# EAGLE design FioSaber Prototype A (EAGLE 6.5.0)
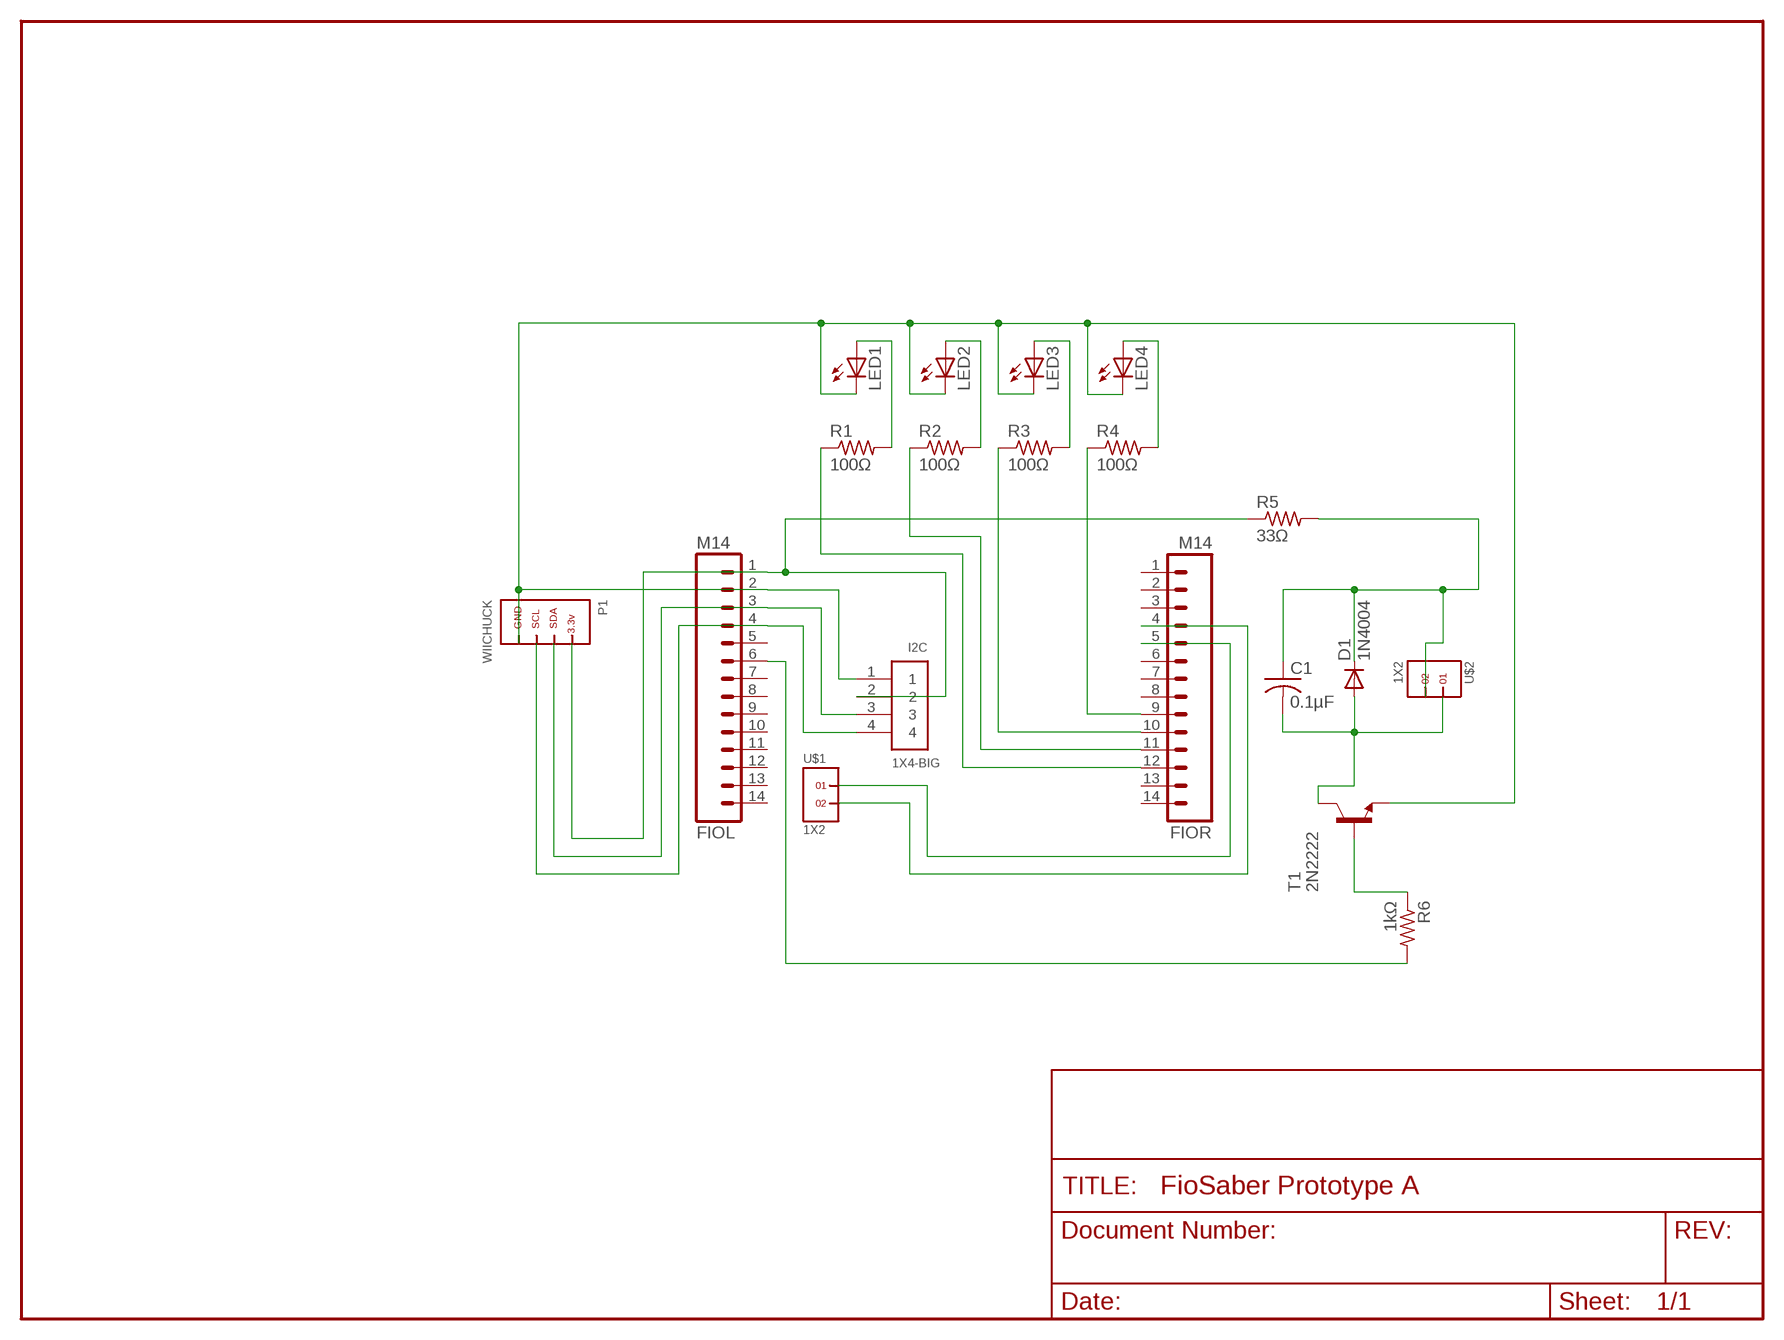
[diagram p0: schematic, sheet 1]

## Parts
C1  0.1µF  C-US025-025X050  [C025-025X050]
D1  1N4004  [DO41-10]
FIOL  M14  [1X14]
FIOR  M14  [1X14]
I2C  1X4-BIG  [1X04-BIG]
LED1  LED3MM  [LED3MM]
LED2  LED3MM  [LED3MM]
LED3  LED3MM  [LED3MM]
LED4  LED3MM  [LED3MM]
P1  WIICHUCK  [MEMOREX_RECEIVER]
R1  100Ω  R-US_0207/10  [0207/10]
R2  100Ω  R-US_0207/10  [0207/10]
R3  100Ω  R-US_0207/10  [0207/10]
R4  100Ω  R-US_0207/10  [0207/10]
R5  33Ω  R-US_0207/10  [0207/10]
R6  1kΩ  R-US_0207/10  [0207/10]
T1  2N2222  [TO92-EBC-OVAL]
U$1  1X2  [1X2]
U$2  1X2  [1X2]

## Nets
N$1: FIOL.1 I2C.2 P1.PWR R5.1
N$3: FIOL.3 I2C.3 P1.SDA
N$4: FIOL.4 I2C.4 P1.SCL
N$5: FIOR.12 R1.1
N$6: FIOR.11 R2.1
N$7: FIOR.10 R3.1
N$8: FIOR.9 R4.1
N$9: LED1.A R1.2
N$10: LED2.A R2.2
N$11: LED3.A R3.2
N$12: LED4.A R4.2
N$13: FIOL.2 I2C.1 LED1.K(C) LED2.K(C) LED3.K(C) LED4.K(C) P1.GND T1.E
N$14: FIOR.4 U$1.2
N$15: FIOR.5 U$1.1
N$16: FIOL.6 R6.2
N$18: R6.1 T1.B
N$19: C1.2 D1.A T1.C U$2.1
N$20: C1.1 D1.C R5.2 U$2.2
Unconnected: FIOL.5 FIOL.7 FIOL.8 FIOL.9 FIOL.10 FIOL.11 FIOL.12 FIOL.13 FIOL.14 FIOR.1 FIOR.2 FIOR.3 FIOR.6 FIOR.7 FIOR.8 FIOR.13 FIOR.14

## Library data of the parts
C1 = rcl:C-US: CAPACITOR, American symbol
D1 = adafruit:1N4004: DIODE General purpose 1N400x type rectifier (With bigger pads) http://www.ladyada.net/library/pcb/eaglelibrary.html
FIOL FIOR = SparkFun:M14: Header 14 Standard 14-pin 0.1" header. Use with straight break away headers (SKU : PRT-00116), right angle break away headers (PRT-00553), swiss pins (PRT-00743), machine pins (PRT-00117), and female headers (PRT-00115).
I2C = adafruit:1X4: 4-pin connector
LED1-LED4 = adafruit:LED: LED OSRAM: - CHIPLED LG R971, LG N971, LY N971, LG Q971, LY Q971, LO R971, LY R971 LH N974, LH R974 LS Q976, LO Q976, LY Q976 LO Q996 - Hyper CHIPLED LW Q18S LB Q993, LB Q99A, LB R99A - SideLED LS A670, LO A670, LY A670, LG A670, LP A670 LB A673, LV A673, LT A673, LW A673 LH A674 LY A675 LS A676, LA A676, LO A676, LY A676, LW A676 LS A679, LY A679, LG A679 - Hyper Micro SIDELED® LS Y876, LA Y876, LO Y876, LY Y876 LT Y87S - SmartLED LW L88C, LW L88S LB L89C, LB L89S, LG L890 LS L89K, LO L89K, LY L89K LS L896, LA L896, LO L896, LY L896 - TOPLED LS T670, LO T670, LY T670, LG T670, LP T670 LSG T670, LSP T670, LSY T670, LOP T670, LYG T670 LG T671, LOG T671, LSG T671 LB T673, LV T673, LT T673, LW T673 LH T674 LS T676, LA T676, LO T676, LY T676, LB T676, LH T676, LSB T676, LW T676 LB T67C, LV T67C, LT T67C, LS T67K, LO T67K, LY T67K, LW E67C LS E67B, LA E67B, LO E67B, LY E67B, LB E67C, LV E67C, LT E67C LW T67C LS T679, LY T679, LG T679 LS T770, LO T770, LY T770, LG T770, LP T770 LB T773, LV T773, LT T773, LW T773 LH T774 LS E675, LA E675, LY E675, LS T675 LS T776, LA T776, LO T776, LY T776, LB T776 LHGB T686 LT T68C, LB T68C - Hyper Mini TOPLED® LB M676 - Mini TOPLED Santana® LG M470 LS M47K, LO M47K, LY M47K Source: http://www.osram.convergy.de/
P1 = nintendo:WIICHUCK
R1-R6 = adafruit:R-US_: RESISTOR, American symbol
T1 = adafruit:2N2222: NPN TRANSISTOR Big oval pads
U$1 U$2 = headers(.1in):1X2

## Net classes
0 Default: width 0.203 mm, clearance 0.205 mm
2 LEDPower: width 0.203 mm
3 ButtonSignal: width 0.203 mm

## Board
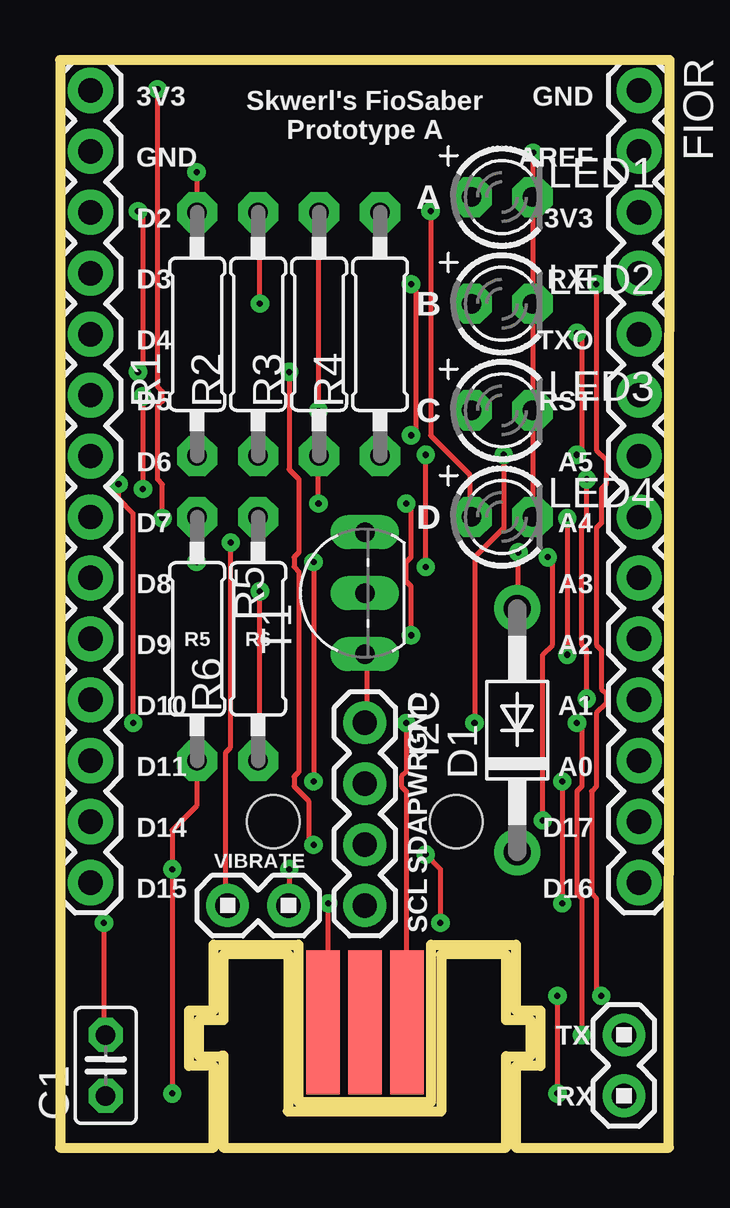
[diagram p1: board, top side]
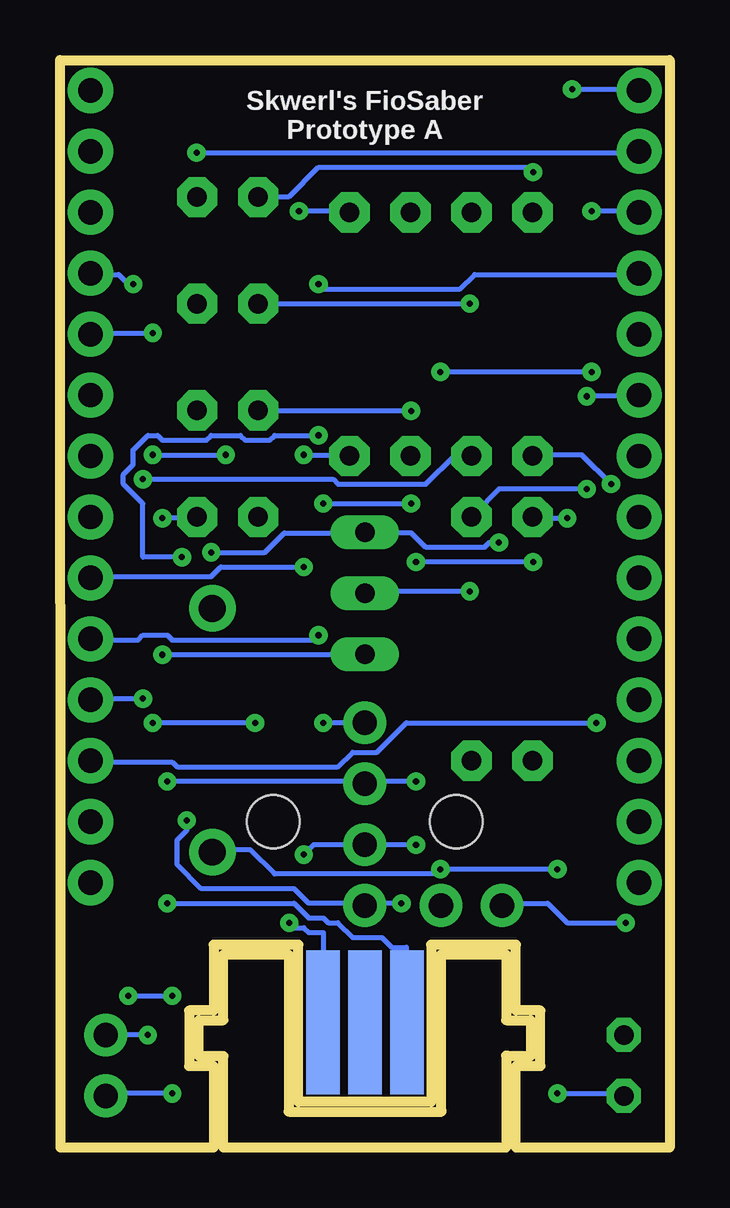
[diagram p2: board, bottom side, seen from below]

Size 25.4 x 45.34 mm. Coordinates in mm from the lower left corner, seen from the top.
Outline: 0,0 6.4,0 6.4,3.4 5.38,3.4 5.38,5.71 6.4,5.71 6.4,8.46 9.93,8.46 9.93,1.91 15.47,1.91 15.47,8.46 19,8.46 19,5.71 20.02,5.71 20.02,3.4 19,3.4 19,0 25.38,0 25.4,45.34 0,45.34 0,0
Copper layers (1*16): Top 0.035mm / dielectric 1.5mm / Bottom 0.035mm
Design rules "SparkFun *": minimum track width 8mil, minimum drill 10mil, track to track 7mil, track to pad 7mil, pad to pad 7mil, via to via 7mil, smd to smd 7mil, copper to edge 10mil, drill to drill 8mil, minimum pad ring 12mil, minimum via ring 10mil, stop-mask expansion 4mil, vias tented up to drill 20mil, thermal gap 10mil
Holes 2.2 mm at 8.89,13.59 16.51,13.59
Milling: area 5.8,0 to 19.6,8.1

### Footprints (pad centres in the part's own frame; a part is rotated, then mirrored left to right if it is on the bottom)
C025-025X050 = drill 0.813 octagon: 1 -1.27,0; 2 1.27,0
DO41-10 = drill 1.118 pad 1.93: A 5.08,0; C -5.08,0
1X14 = drill 1.016 pad 1.88: 1 0,0; 2 2.54,0; 3 5.08,0; 4 7.62,0; 5 10.16,0; 6 12.7,0; 7 15.24,0; 8 17.78,0; 9 20.32,0; 10 22.86,0; 11 25.4,0; 12 27.94,0; 13 30.48,0; 14 33.02,0
1X04-BIG = drill 1.016 pad 1.778: 1 0,0; 2 2.54,0; 3 5.08,0; 4 7.62,0
LED3MM = drill 0.813 pad 1.676 octagon: A -1.27,0; K 1.27,0
MEMOREX_RECEIVER = smd 1.4 x 6 bottom: ATT 0,5.6; PWR -1.75,5.6; SDA 1.75,5.6 | smd 1.4 x 6: GND 1.75,5.6; NC 0,5.6; SCL -1.75,5.6
0207/10 = drill 0.813 pad 1.676 octagon: 1 -5.08,0; 2 5.08,0
TO92-EBC-OVAL = drill 0.813 long: B 0,-1.27; C 2.54,-1.27; E -2.54,-1.27
1X2 = drill 1.016 pad 1.778: 1 0,0; 2 2.54,0

### Placement (x,y rotation side)
C1  1.91,3.43 90 top
D1  19.05,17.4 90 top
FIOL  1.27,44.07 270 top
FIOR  24.13,44.07 270 top
I2C  12.7,17.72 270 top
LED1  18.41,39.62 0 top
LED2  18.41,35.18 0 top
LED3  18.41,30.73 0 top
LED4  18.41,26.29 0 top
P1  12.7,-0.38 0 top
R1  5.71,33.91 90 top
R2  8.26,33.91 90 top
R3  10.79,33.91 90 top
R4  13.34,33.91 90 top
R5  5.71,21.21 270 top
R6  8.26,21.21 90 top
T1  11.43,23.11 90 top
U$1  23.5,4.7 270 top
U$2  6.99,10.1 0 top

### Tracks (layer width: path | path; a pad name or v marks a point on that pad's centre or on a via)
N$1  (via drill 0.25)
  Top 0.203: v10.57,24.41 v10.57,15.27 | v5.69,24.41 5.69,26.24 R5.1 | v4.06,44.12 4.06,31.73 4.27,31.52 4.27,31.11 4.06,30.91 4.06,27.86 4.27,27.66 v4.27,26.24 | v20.93,15.27 v20.93,10.19
  Bottom 0.203: v10.57,15.27 12.6,15.27 I2C.2 12.8,15.27 v20.93,15.27 | v5.69,24.41 v10.57,24.41 | v4.06,44.12 1.42,44.12 FIOL.1 | v4.27,26.24 5.69,26.24 R5.1 | v20.93,10.19 15.65,10.19 15.04,9.58 14.43,9.58 14.22,9.37 13.82,9.37 13.21,8.76 11.99,8.76 11.58,8.36 10.97,8.36 10.97,5.31 P1.PWR
N$3  (via drill 0.25)
  Top 0.203: v10.57,12.62 10.36,12.83 10.36,14.45 9.75,15.06 9.75,15.47 9.96,15.67 9.96,24 9.75,24.21 9.75,24.61 9.96,24.82 9.96,27.86 9.55,28.27 v9.55,32.33 | v3.25,32.33 3.45,32.54 3.45,38.84 v3.25,39.04 | v15.85,9.37 15.85,11.61 v15.24,12.22
  Bottom 0.203: v10.57,12.62 12.6,12.62 I2C.3 12.8,12.62 14.83,12.62 v15.24,12.22 | v3.25,32.33 v9.55,32.33 | v3.25,39.04 1.42,39.04 FIOL.3 | v15.85,9.37 15.65,9.17 15.24,9.17 15.04,8.97 14.43,8.97 14.43,5.31 P1.SDA
N$4  (via drill 0.25)
  Top 0.203: v11.18,10.19 11.18,7.34 10.97,7.14 10.97,5.31 P1.SCL | v14.63,35.99 14.83,35.79 14.83,29.9 v14.63,29.69 | v20.32,24.61 20.52,24.41 20.52,20.95 20.12,20.55 v20.12,13.64
  Bottom 0.203: v11.18,10.19 12.6,10.19 I2C.4 12.8,10.19 15.04,10.19 15.65,10.79 19.51,10.79 20.52,11.81 20.52,12.83 20.12,13.23 v20.12,13.64 | v14.63,35.99 14.43,35.79 8.74,35.79 8.13,36.4 1.42,36.4 FIOL.4 | v14.63,29.69 16.46,29.69 16.66,29.49 17.68,29.49 17.88,29.69 19.1,29.69 19.3,29.49 21.13,29.49 21.34,29.69 21.74,29.69 22.35,29.08 22.35,28.47 22.76,28.07 22.76,27.66 21.95,26.85 21.95,24.61 v20.32,24.61
N$5  (via drill 0.25)
  Top 0.203: v2.44,27.66 2.44,27.05 3.05,26.44 v3.05,17.7
  Bottom 0.203: v2.44,27.66 3.66,28.88 5.69,28.88 R1.1 | v3.05,17.7 10.97,17.7 12.19,16.48 13.21,16.48 13.82,15.88 20.52,15.88 20.73,16.08 23.98,16.08 FIOR.12
N$6  (via drill 0.25)
  Top 0.203: v21.95,27.86 21.95,26.04 21.74,25.83 21.74,20.95 21.95,20.75 v21.95,18.72
  Bottom 0.203: v21.95,27.86 14.02,27.86 13.82,27.66 10.16,27.66 8.94,28.88 8.33,28.88 R2.1 | v21.95,18.72 23.98,18.72 FIOR.11
N$7  (via drill 0.25)
  Top 0.203: v10.77,26.85 10.77,28.68 R3.1 | v14.43,26.85 14.63,26.64 14.63,24.61 14.43,24.41 14.43,23.6 14.63,23.39 v14.63,21.36
  Bottom 0.203: v14.43,26.85 v10.77,26.85 | v14.63,21.36 14.83,21.16 20.73,21.16 20.93,21.36 21.95,21.36 22.15,21.16 23.98,21.16 FIOR.10
N$8  (via drill 0.25)
  Top 0.203: v15.24,24.21 v15.24,28.88
  Bottom 0.203: v15.24,28.88 13.41,28.88 R4.1 | v15.24,24.21 18.69,24.21 19.1,23.8 23.98,23.8 FIOR.9
N$9  (via drill 0.25)
  Top 0.203: v5.69,40.66 5.69,39.04 R1.2
  Bottom 0.203: v5.69,40.66 5.89,40.87 14.63,40.87 15.85,39.65 17.07,39.65 LED1.A
N$10  (via drill 0.25)
  Top 0.203: v8.33,35.18 8.33,38.84 R2.2
  Bottom 0.203: LED2.A v8.33,35.18
N$11  (via drill 0.25)
  Top 0.203: v10.77,30.71 10.77,38.84 R3.2
  Bottom 0.203: v10.77,30.71 17.07,30.71 LED3.A
N$12  (via drill 0.25)
  Top 0.203: v15.44,39.04 15.44,29.69 17.07,28.07 17.07,26.44 LED4.A
  Bottom 0.203: v15.44,39.04 13.41,39.04 R4.2
N$13  (via drill 0.25)
  Top 0.203: T1.E 12.8,20.55 12.8,17.91 I2C.1 | LED4.K 19.71,26.44 19.71,30.71 LED3.K 19.71,30.91 19.71,35.18 | 19.71,35.18 19.71,39.45 LED1.K 19.71,39.65 v19.71,41.48 | 19.71,35.18 LED2.K | v21.13,26.24 v21.13,20.55 | v14.43,17.7 14.43,15.67 14.22,15.47 14.22,15.06 14.43,14.86 14.43,5.31 P1.GND
  Bottom 0.203: v19.71,41.48 1.42,41.48 FIOL.2 | v21.13,20.55 12.8,20.55 T1.E | v21.13,26.24 19.71,26.24 LED4.K | v14.43,17.7 12.8,17.7 I2C.1
N$14  (via drill 0.25)
  Top 0.203: v20.73,6.33 v20.73,2.26 | v22.55,6.33 22.35,6.53 22.35,10.39 22.15,10.59 22.15,14.86 22.35,15.06 22.35,18.11 22.76,18.52 22.76,18.92 22.55,19.13 22.55,20.75 22.35,20.95 22.35,25.83 22.55,26.04 22.55,27.46 22.76,27.66 22.76,28.68 22.35,29.08 v22.35,35.99
  Bottom 0.203: v20.73,2.26 23.37,2.26 U$1.2 | v22.55,6.33 v20.73,6.33 | v22.35,35.99 22.55,35.99 22.96,36.4 23.98,36.4 FIOR.4
N$15  (via drill 0.25)
  Top 0.203: v21.74,4.7 21.74,10.39 21.54,10.59 21.54,14.86 21.74,15.06 21.74,17.5 v21.54,17.7 | v17.27,17.7 17.27,24.61 18.49,25.83 v18.49,28.88 | v21.54,28.88 21.74,29.08 21.74,33.76 v21.54,33.96
  Bottom 0.203: v21.74,4.7 U$1.1 | v17.27,17.7 v21.54,17.7 | v21.54,28.88 v18.49,28.88 | v21.54,33.96 23.98,33.96 FIOR.5
N$16  (via drill 0.25)
  Top 0.203: v3.45,31.32 v3.45,27.46
  Bottom 0.203: v3.45,27.46 7.11,27.46 8.13,26.44 R6.2 | v3.45,31.32 1.42,31.32 FIOL.6
N$18  (via drill 0.25)
  Top 0.203: v8.33,23.19 8.33,16.28 R6.1
  Bottom 0.203: v8.33,23.19 12.6,23.19 T1.B
N$19  (via drill 0.25)
  Top 0.203: v19.1,24.82 19.1,22.58 D1.A | v1.83,9.37 1.83,4.7 C1.2 | v7.11,25.22 7.11,16.69 6.91,16.48 6.91,10.19 U$2.1
  Bottom 0.203: v19.1,24.82 16.87,24.82 16.05,25.63 12.8,25.63 T1.C 12.6,25.63 10.77,25.63 10.16,25.02 7.72,25.02 7.52,25.22 v7.11,25.22 | v1.83,9.37 4.27,9.37 5.08,10.19 6.91,10.19 U$2.1
N$20  (via drill 0.25)
  Top 0.203: v4.67,2.26 v4.67,11.61 4.67,13.23 5.69,14.25 5.69,16.08 R5.2 | v9.55,11.61 9.55,10.19 U$2.2
  Bottom 0.203: v4.67,2.26 2.03,2.26 C1.1 | v4.67,11.61 v9.55,11.61 9.75,11.4 16.46,11.4 17.48,12.42 18.9,12.42 D1.C

### Text on the board
tPlace: 3V3 | Skwerl's FioSaber / Prototype A | GND | GND | AREF | A | D2 | 3V3 | D3 | B | RXI | D4 | TXO | D5 | C | RST | D6 | A5 | D | D7 | A4 | D8 | A3 | R5 | R6 | D9 | A2 | D10 | GND | A1 | D11 | PWR | A0 | D14 | SDA | D17 | VIBRATE | D15 | D16 | SCL | TX | RX
bPlace: Skwerl's FioSaber / Prototype A